# Altium schematic sheet Motor_Measure.SchDoc
size A4; SheetNumber: 2; SheetTotal: 2
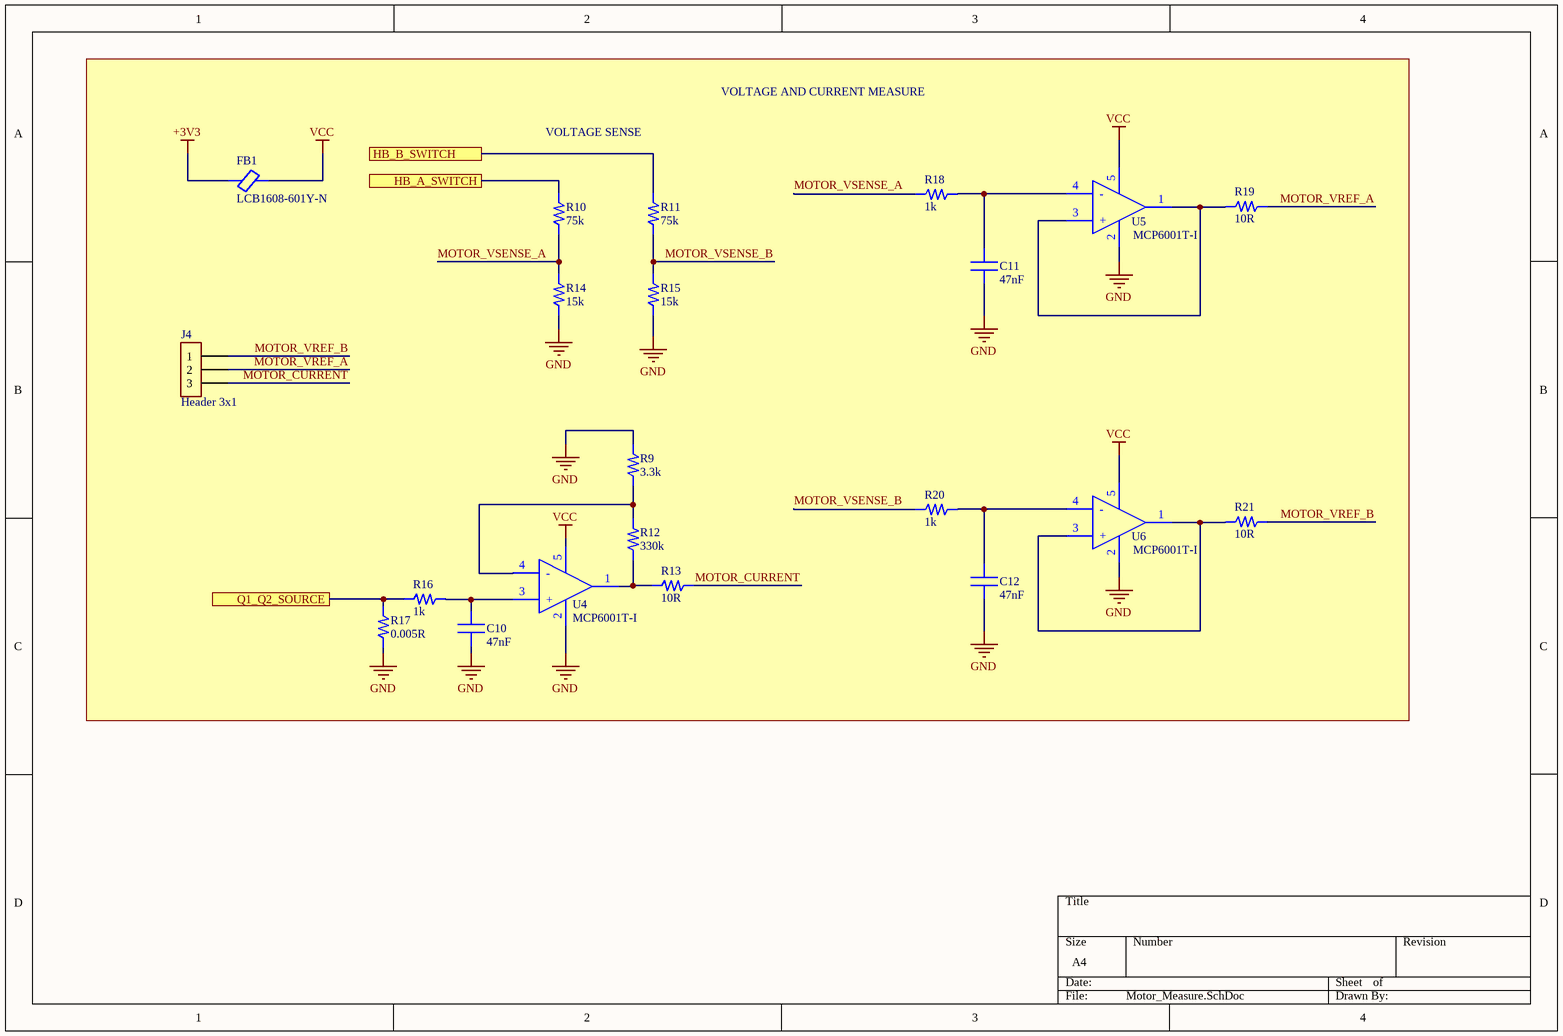
[diagram p0: Motor_Measure.SchDoc]

## Parts
C10  47nF  [CAPC2012X145N 0805]
C11  47nF  [CAPC2012X145N 0805]
C12  47nF  [CAPC2012X145N 0805]
FB1  LCB1608-601Y-N  [MPZ1608S601ATA00 0603 1608X95N]
J4  Header 3x1  [JST_B3B-PH-K-S 1x3 Header]
R9  3.3k  [RES 0805 YAGEO C2012X60N]
R10  75k  [RES 0805 YAGEO C2012X60N]
R11  75k  [RES 0805 YAGEO C2012X60N]
R12  330k  [RES 0603 ROYALOHM]
R13  10R  [RES 0805 YAGEO C2012X60N]
R14  15k  [RES 0805 YAGEO C2012X60N]
R15  15k  [RES 0805 YAGEO C2012X60N]
R16  1k  [RES 0805 YAGEO C2012X60N]
R17  0.005R  [RES 1206 YAGEO]
R18  1k  [RES 0805 YAGEO C2012X60N]
R19  10R  [RES 0805 YAGEO C2012X60N]
R20  1k  [RES 0805 YAGEO C2012X60N]
R21  10R  [RES 0805 YAGEO C2012X60N]
U4  MCP6001T-I  [MCP6001T-I/OT OPAMP SOT-23-5]
U5  MCP6001T-I  [MCP6001T-I/OT OPAMP SOT-23-5]
U6  MCP6001T-I  [MCP6001T-I/OT OPAMP SOT-23-5]

## Ports
HB_A_SWITCH (see Power_And_Driver[4A]), HB_B_SWITCH (see Power_And_Driver[4A]), Q1_Q2_SOURCE (see Power_And_Driver[4A])

## Nets
+3V3: FB1.1
GND: C10.1 C11.1 C12.1 R9.2 R14.1 R15.1 R17.1 U4.2(VSS) U5.2(VSS) U6.2(VSS)
VCC: FB1.2 U4.5(VDD) U5.5(VDD) U6.5(VDD)
HB_A_SWITCH: R10.2 ; port HB_A_SWITCH
HB_B_SWITCH: R11.2 ; port HB_B_SWITCH
MOTOR_CURRENT: J4.3 R13.2
MOTOR_VREF_A: J4.2 R19.2
MOTOR_VREF_B: J4.1 R21.2
MOTOR_VSENSE_A: R10.1 R14.2 R18.1
MOTOR_VSENSE_B: R11.1 R15.2 R20.1
Q1_Q2_SOURCE: R16.1 R17.2 ; port Q1_Q2_SOURCE
NetC10_2: C10.2 R16.2 U4.3(+)
NetC11_2: C11.2 R18.2 U5.4(-)
NetC12_2: C12.2 R20.2 U6.4(-)
NetR9_1: R9.1 R12.2 U4.4(-)
NetR12_1: R12.1 R13.1 U4.1(Vout)
NetR19_1: R19.1 U5.1(Vout) U5.3(+)
NetR21_1: R21.1 U6.1(Vout) U6.3(+)

## Notes on the sheet
- VOLTAGE AND CURRENT MEASURE
- VOLTAGE SENSE

## Library data of the parts
C10-C12 = CAP 0805 47nF CL21B473KBCNNNC: CL21B473KBCNNNC; Manufacturer: SAMSUNG; Voltage Rating: 50 VDC; Dielectric: X7R; Tolerance: ±10 %; Capacitance: 47nF; Package Size: 0805; Operating Temp.: -55 °C ~ +125 °C; Manufacturer Product Number: CL21B473KBCNNNC; ComponentLink1Description: Product Site; ComponentLink1URL: https://www.ozdisan.com/p/smt-smd-ve-mlcc-kapasitorler-184/samsung-cl21b473kbcnnnc-10433
FB1 = Ferrite Bead LCB1608-601Y-N: 600 Ohms @ 100 MHz 1 Power Line Ferrite Bead 0603 (1608 Metric) 1A 200mOhm; Manufacturer: CORE MASTER; Tolerance: ±25 %; DCR: 200 m Ohms; Impedance: 600 Ohms; Current: 1 A; Package Size: 0603; Manufacturer Code: LCB1608-601Y-N; ComponentLink1Description: Product Site; ComponentLink1URL: http://ozdisan.com/p/bead-feritler-469/core-master-lcb1608-601y-n-496992
J4 = Header 3x1 DS1066-3MVW6X: CON.T.B.2.00MM 3P 180C MALE CONNFLY; Pitch - Mating: 0.079" (2.00mm); Mounting Type: Through Hole; Contact Type: Male Pin; Series: PH; Manufacturer Product Number: DS1066-3MVW6X; Manufacturer: CONNFLY; ComponentLink1Description: Product Site; ComponentLink1URL: https://www.ozdisan.com/p/pcb-konnektorler-310/connfly-ds1066-3mvw6x-493781
R9 = RES 0805 3.3k Ohms 0805S8F3301TDE: RES.(2012) 0805 3.3K Ohms 1% 1/8W-S 100PPM; Manufacturer: ROYALOHM; Power: 1/8W; Max Working Current: 5A; Max Working Voltage: 150VDC; Resistance: 3.3k Ohms; Tolerance: ±1 %; Package / Case: 0805; Manufacturer Code: 0805S8F3301TDE; ComponentLink1Description: Product Site; ComponentLink1URL: https://www.ozdisan.com/p/smt-smd-ve-cip-direncler-194/royalohm-0805s8f3301tde-502827
R10 R11 = RES 0805 75 kOhms 0805S8F7502T5E: RES.(2012) 0805 75K Ohms 1% 1/8W-S 100PPM; Manufacturer: ROYALOHM; Power: 1/8W; Max Working Current: 5A; Max Working Voltage: 150VDC; Resistance: 75 kOhms; Tolerance: ±1 %; Package / Case: 0805; Manufacturer Code: 0805S8F7502T5E; ComponentLink1Description: Product Site; ComponentLink1URL: https://www.ozdisan.com/p/smt-smd-ve-cip-direncler-194/royalohm-tc0525d1502t5g-569982
R12 = RES 0603 330k 0603SAF3303T5E: RES.(1608) 0603 330K Ohms 1% 1/10W-S 100PPM; Manufacturer: ROYALOHM; Power (Watts): 0.1W, 1/10W; Tolerance: ±5 %; Operating Temperature: -55°C ~ 155°C; Package / Case: 0603 (1608 Metric); Manufacturer Product Number: 0603SAF3303T5E; Resistance: 330 kOhms; ComponentLink1Description: Product Site; ComponentLink1URL: https://www.ozdisan.com/p/smt-smd-ve-cip-direncler-194/royalohm-0603saf3303t5e-358867
R13 R19 R21 = RES 0805 10 Ohms 0805S8J0100T5E: RES.(2012) 0805 10 Ohms 5% 1/8W-S 400PPM; Manufacturer: ROYALOHM; Resistance: 10 Ohms; Power: 1/8W; Tolerance: ±1 %; Max Working Current: 5A; Max Working Voltage: 150VDC; Package / Case: 0805; Manufacturer Code: 0805S8J0100T5E; ComponentLink1Description: Product Site; ComponentLink1URL: https://www.ozdisan.com/p/smt-smd-ve-cip-direncler-194/royalohm-0805s8j0100t5e-29704
R14 R15 = RES 0805 15 kOhms TC0525D1502T5G: RES.(2012) 0805 15K Ohms 0.5% 1/8W 25PPM; Manufacturer: ROYALOHM; Tolerance: ±1 %; Max Working Current: 5A; Max Working Voltage: 150VDC; Resistance: 15 kOhms; Power: 1/8W; Package / Case: 0805; Manufacturer Code: TC0525D1502T5G; ComponentLink1Description: Product Site; ComponentLink1URL: https://www.ozdisan.com/p/smt-smd-ve-cip-direncler-194/royalohm-tc0525d1502t5g-569982
R16 R18 R20 = RES 0805 1k Ohms 0805S8F1001TDE: RES.(2012) 0805 1K Ohms 1% 1/8W-S 100PPM; Manufacturer: ROYALOHM; Resistance: 1k Ohms; Power: 1/8W; Max Working Current: 5A; Max Working Voltage: 150VDC; Tolerance: ±1 %; Package / Case: 0805; Manufacturer Code: 0805S8F1001TDE; ComponentLink1Description: Product Site; ComponentLink1URL: https://www.ozdisan.com/p/smt-smd-ve-cip-direncler-194/royalohm-0805s8f1001tde-356631
R17 = RES 1206 5 mOhms PE1206FRF070R005L: RES.(3216) 1206 5m Ohms 1% 1/4W 100PPM AEC-Q200 SM; Manufacturer: YAGEO; Resistance: 5 mOhms; Max Working Current: 5A; Max Working Voltage: 150; Power: 1/4W; Tolerance: ±1 %; Package / Case: 0805; Manufacturer Code: PE1206FRF070R005L; ComponentLink1Description: Product Site; ComponentLink1URL: https://www.ozdisan.com/p/smt-smd-ve-cip-direncler-194/yageo-pe1206frf070r005l-854695
U4-U6 = MCP6001T-I/OT OP-AMP 1 CH LOW POWER: Standard (General Purpose) Amplifier 1 Circuit Rail-to-Rail SOT-23-5; Manufacturer: Microchip Technology; Voltage - Supply Span (Min) - (Max): 1.8V to 6V; Voltage - Input Offset: 4.5 mV; Current - Output / Channel: 23 mA; Current - Supply: 100µA; Gain Bandwidth Product: 1 MHz; Operating Temperature: -40°C ~ 85°C; Output Type: Rail-to-Rail; Manufacturer Product Number: MCP6001T-I/OT; Package / Case: SOT-23-5; ComponentLink1Description: Product Site; ComponentLink1URL: https://www.ozdisan.com/p/amplifikatorler-242/microchip-mcp6001t-i-ot-40820